# EAGLE design LED Daughterboard (EAGLE 8.4.1)
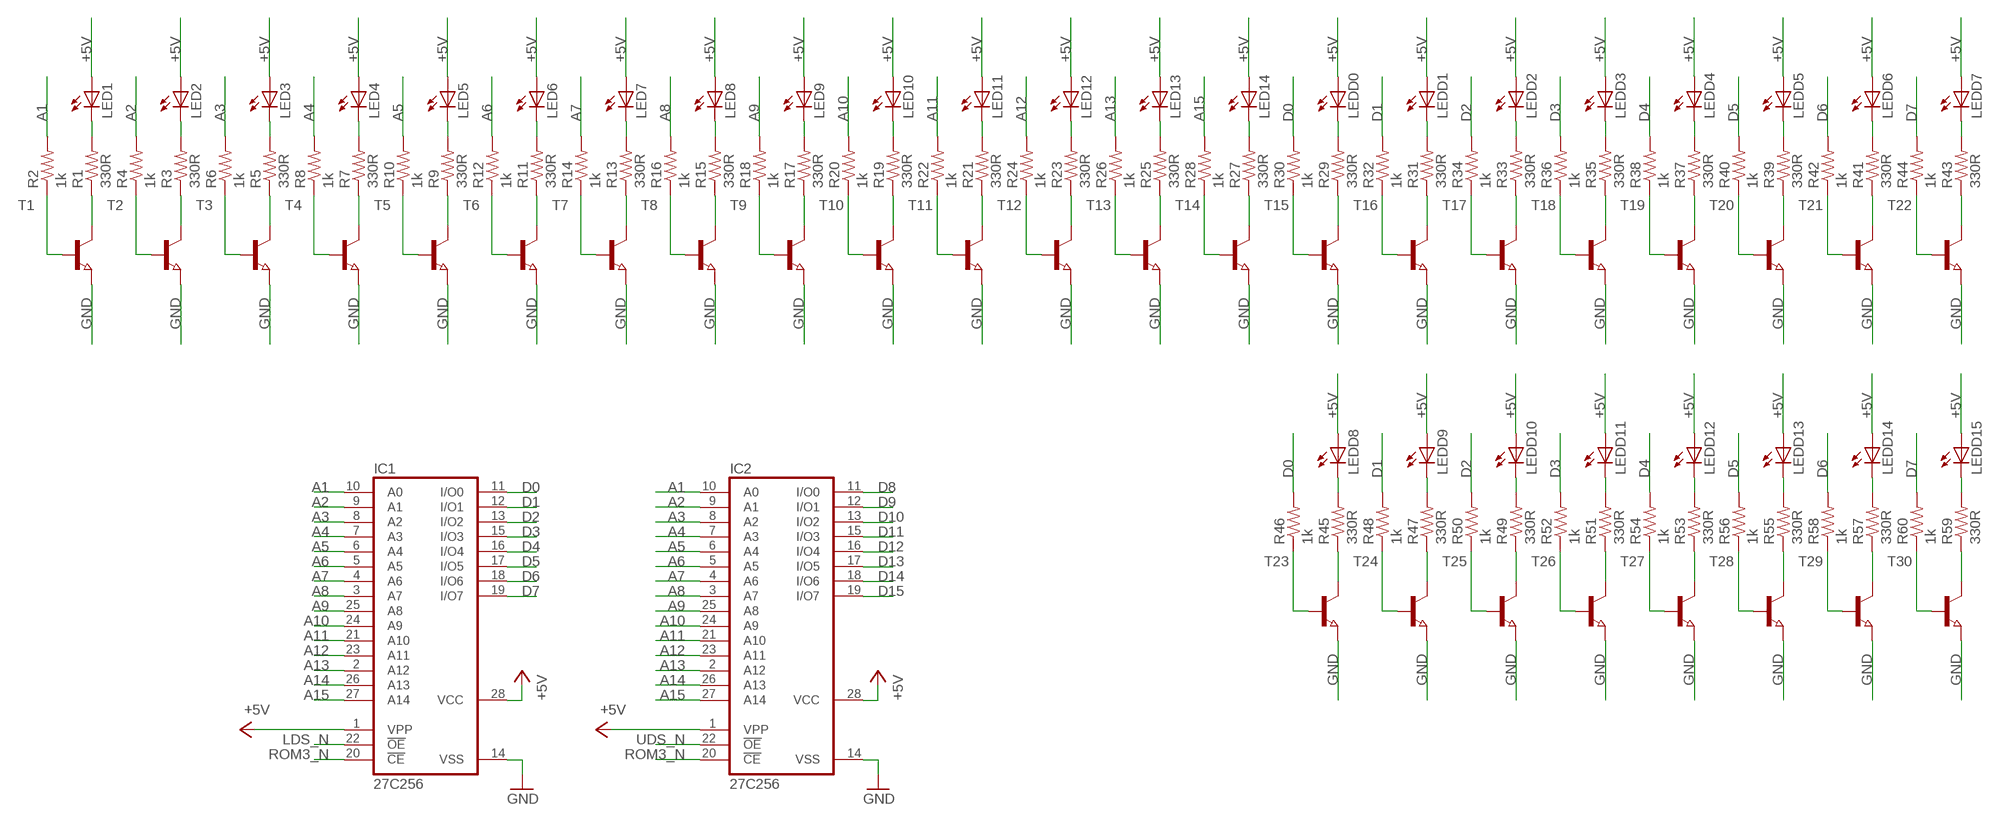
[diagram p0: schematic, sheet 1]

## Parts
IC1  27C256  27C256AG  [DIL28-6]
IC2  27C256  27C256AG  [DIL28-6]
LED1  LEDCHIP-LED0805  [CHIP-LED0805]
LED2  LEDCHIP-LED0805  [CHIP-LED0805]
LED3  LEDCHIP-LED0805  [CHIP-LED0805]
LED4  LEDCHIP-LED0805  [CHIP-LED0805]
LED5  LEDCHIP-LED0805  [CHIP-LED0805]
LED6  LEDCHIP-LED0805  [CHIP-LED0805]
LED7  LEDCHIP-LED0805  [CHIP-LED0805]
LED8  LEDCHIP-LED0805  [CHIP-LED0805]
LED9  LEDCHIP-LED0805  [CHIP-LED0805]
LED10  LEDCHIP-LED0805  [CHIP-LED0805]
LED11  LEDCHIP-LED0805  [CHIP-LED0805]
LED12  LEDCHIP-LED0805  [CHIP-LED0805]
LED13  LEDCHIP-LED0805  [CHIP-LED0805]
LED14  LEDCHIP-LED0805  [CHIP-LED0805]
LEDD0  LEDCHIP-LED0805  [CHIP-LED0805]
LEDD1  LEDCHIP-LED0805  [CHIP-LED0805]
LEDD2  LEDCHIP-LED0805  [CHIP-LED0805]
LEDD3  LEDCHIP-LED0805  [CHIP-LED0805]
LEDD4  LEDCHIP-LED0805  [CHIP-LED0805]
LEDD5  LEDCHIP-LED0805  [CHIP-LED0805]
LEDD6  LEDCHIP-LED0805  [CHIP-LED0805]
LEDD7  LEDCHIP-LED0805  [CHIP-LED0805]
LEDD8  LEDCHIP-LED0805  [CHIP-LED0805]
LEDD9  LEDCHIP-LED0805  [CHIP-LED0805]
LEDD10  LEDCHIP-LED0805  [CHIP-LED0805]
LEDD11  LEDCHIP-LED0805  [CHIP-LED0805]
LEDD12  LEDCHIP-LED0805  [CHIP-LED0805]
LEDD13  LEDCHIP-LED0805  [CHIP-LED0805]
LEDD14  LEDCHIP-LED0805  [CHIP-LED0805]
LEDD15  LEDCHIP-LED0805  [CHIP-LED0805]
R1  330R  R-US_M0805  [M0805]
R2  1k  R-US_M0805  [M0805]
R3  330R  R-US_M0805  [M0805]
R4  1k  R-US_M0805  [M0805]
R5  330R  R-US_M0805  [M0805]
R6  1k  R-US_M0805  [M0805]
R7  330R  R-US_M0805  [M0805]
R8  1k  R-US_M0805  [M0805]
R9  330R  R-US_M0805  [M0805]
R10  1k  R-US_M0805  [M0805]
R11  330R  R-US_M0805  [M0805]
R12  1k  R-US_M0805  [M0805]
R13  330R  R-US_M0805  [M0805]
R14  1k  R-US_M0805  [M0805]
R15  330R  R-US_M0805  [M0805]
R16  1k  R-US_M0805  [M0805]
R17  330R  R-US_M0805  [M0805]
R18  1k  R-US_M0805  [M0805]
R19  330R  R-US_M0805  [M0805]
R20  1k  R-US_M0805  [M0805]
R21  330R  R-US_M0805  [M0805]
R22  1k  R-US_M0805  [M0805]
R23  330R  R-US_M0805  [M0805]
R24  1k  R-US_M0805  [M0805]
R25  330R  R-US_M0805  [M0805]
R26  1k  R-US_M0805  [M0805]
R27  330R  R-US_M0805  [M0805]
R28  1k  R-US_M0805  [M0805]
R29  330R  R-US_M0805  [M0805]
R30  1k  R-US_M0805  [M0805]
R31  330R  R-US_M0805  [M0805]
R32  1k  R-US_M0805  [M0805]
R33  330R  R-US_M0805  [M0805]
R34  1k  R-US_M0805  [M0805]
R35  330R  R-US_M0805  [M0805]
R36  1k  R-US_M0805  [M0805]
R37  330R  R-US_M0805  [M0805]
R38  1k  R-US_M0805  [M0805]
R39  330R  R-US_M0805  [M0805]
R40  1k  R-US_M0805  [M0805]
R41  330R  R-US_M0805  [M0805]
R42  1k  R-US_M0805  [M0805]
R43  330R  R-US_M0805  [M0805]
R44  1k  R-US_M0805  [M0805]
R45  330R  R-US_M0805  [M0805]
R46  1k  R-US_M0805  [M0805]
R47  330R  R-US_M0805  [M0805]
R48  1k  R-US_M0805  [M0805]
R49  330R  R-US_M0805  [M0805]
R50  1k  R-US_M0805  [M0805]
R51  330R  R-US_M0805  [M0805]
R52  1k  R-US_M0805  [M0805]
R53  330R  R-US_M0805  [M0805]
R54  1k  R-US_M0805  [M0805]
R55  330R  R-US_M0805  [M0805]
R56  1k  R-US_M0805  [M0805]
R57  330R  R-US_M0805  [M0805]
R58  1k  R-US_M0805  [M0805]
R59  330R  R-US_M0805  [M0805]
R60  1k  R-US_M0805  [M0805]
T1  NPN-TRANSISTOR_SOT23  [SOT23]
T2  NPN-TRANSISTOR_SOT23  [SOT23]
T3  NPN-TRANSISTOR_SOT23  [SOT23]
T4  NPN-TRANSISTOR_SOT23  [SOT23]
T5  NPN-TRANSISTOR_SOT23  [SOT23]
T6  NPN-TRANSISTOR_SOT23  [SOT23]
T7  NPN-TRANSISTOR_SOT23  [SOT23]
T8  NPN-TRANSISTOR_SOT23  [SOT23]
T9  NPN-TRANSISTOR_SOT23  [SOT23]
T10  NPN-TRANSISTOR_SOT23  [SOT23]
T11  NPN-TRANSISTOR_SOT23  [SOT23]
T12  NPN-TRANSISTOR_SOT23  [SOT23]
T13  NPN-TRANSISTOR_SOT23  [SOT23]
T14  NPN-TRANSISTOR_SOT23  [SOT23]
T15  NPN-TRANSISTOR_SOT23  [SOT23]
T16  NPN-TRANSISTOR_SOT23  [SOT23]
T17  NPN-TRANSISTOR_SOT23  [SOT23]
T18  NPN-TRANSISTOR_SOT23  [SOT23]
T19  NPN-TRANSISTOR_SOT23  [SOT23]
T20  NPN-TRANSISTOR_SOT23  [SOT23]
T21  NPN-TRANSISTOR_SOT23  [SOT23]
T22  NPN-TRANSISTOR_SOT23  [SOT23]
T23  NPN-TRANSISTOR_SOT23  [SOT23]
T24  NPN-TRANSISTOR_SOT23  [SOT23]
T25  NPN-TRANSISTOR_SOT23  [SOT23]
T26  NPN-TRANSISTOR_SOT23  [SOT23]
T27  NPN-TRANSISTOR_SOT23  [SOT23]
T28  NPN-TRANSISTOR_SOT23  [SOT23]
T29  NPN-TRANSISTOR_SOT23  [SOT23]
T30  NPN-TRANSISTOR_SOT23  [SOT23]

## Nets
+5V: IC1.1(VPP) IC1.28(VCC) IC2.1(VPP) IC2.28(VCC) LED1.A LED2.A LED3.A LED4.A LED5.A LED6.A LED7.A LED8.A LED9.A LED10.A LED11.A LED12.A LED13.A LED14.A LEDD0.A LEDD1.A LEDD2.A LEDD3.A LEDD4.A LEDD5.A LEDD6.A LEDD7.A LEDD8.A LEDD9.A LEDD10.A LEDD11.A LEDD12.A LEDD13.A LEDD14.A LEDD15.A
A1: IC1.10(A0) IC2.10(A0) R2.2
A2: IC1.9(A1) IC2.9(A1) R4.2
A3: IC1.8(A2) IC2.8(A2) R6.2
A4: IC1.7(A3) IC2.7(A3) R8.2
A5: IC1.6(A4) IC2.6(A4) R10.2
A6: IC1.5(A5) IC2.5(A5) R12.2
A7: IC1.4(A6) IC2.4(A6) R14.2
A8: IC1.3(A7) IC2.3(A7) R16.2
A9: IC1.25(A8) IC2.25(A8) R18.2
A10: IC1.24(A9) IC2.24(A9) R20.2
A11: IC1.21(A10) IC2.21(A10) R22.2
A12: IC1.23(A11) IC2.23(A11) R24.2
A13: IC1.2(A12) IC2.2(A12) R26.2
A14: IC1.26(A13) IC2.26(A13)
A15: IC1.27(A14) IC2.27(A14) R28.2
D0: IC1.11(I/O0) R30.2 R46.2
D1: IC1.12(I/O1) R32.2 R48.2
D2: IC1.13(I/O2) R34.2 R50.2
D3: IC1.15(I/O3) R36.2 R52.2
D4: IC1.16(I/O4) R38.2 R54.2
D5: IC1.17(I/O5) R40.2 R56.2
D6: IC1.18(I/O6) R42.2 R58.2
D7: IC1.19(I/O7) R44.2 R60.2
D8: IC2.11(I/O0)
D9: IC2.12(I/O1)
D10: IC2.13(I/O2)
D11: IC2.15(I/O3)
D12: IC2.16(I/O4)
D13: IC2.17(I/O5)
D14: IC2.18(I/O6)
D15: IC2.19(I/O7)
GND: IC1.14(VSS) IC2.14(VSS) T1.2(E) T2.2(E) T3.2(E) T4.2(E) T5.2(E) T6.2(E) T7.2(E) T8.2(E) T9.2(E) T10.2(E) T11.2(E) T12.2(E) T13.2(E) T14.2(E) T15.2(E) T16.2(E) T17.2(E) T18.2(E) T19.2(E) T20.2(E) T21.2(E) T22.2(E) T23.2(E) T24.2(E) T25.2(E) T26.2(E) T27.2(E) T28.2(E) T29.2(E) T30.2(E)
LDS_N: IC1.22(!OE)
N$1: R2.1 T1.1(B)
N$2: LED1.C R1.2
N$3: R1.1 T1.3(C)
N$4: LEDD4.C R37.2
N$5: LED2.C R3.2
N$6: R3.1 T2.3(C)
N$7: R4.1 T2.1(B)
N$8: LED3.C R5.2
N$9: R5.1 T3.3(C)
N$10: R6.1 T3.1(B)
N$11: LED4.C R7.2
N$12: R7.1 T4.3(C)
N$13: R8.1 T4.1(B)
N$14: LED5.C R9.2
N$15: R9.1 T5.3(C)
N$16: R10.1 T5.1(B)
N$17: LED6.C R11.2
N$18: R11.1 T6.3(C)
N$19: R12.1 T6.1(B)
N$20: LED7.C R13.2
N$21: R13.1 T7.3(C)
N$22: R14.1 T7.1(B)
N$23: LED8.C R15.2
N$24: R15.1 T8.3(C)
N$25: R16.1 T8.1(B)
N$26: LED9.C R17.2
N$27: R17.1 T9.3(C)
N$28: R18.1 T9.1(B)
N$29: LED10.C R19.2
N$30: R19.1 T10.3(C)
N$31: R20.1 T10.1(B)
N$32: LED11.C R21.2
N$33: R21.1 T11.3(C)
N$34: R22.1 T11.1(B)
N$35: LED12.C R23.2
N$36: R23.1 T12.3(C)
N$37: R24.1 T12.1(B)
N$38: LED13.C R25.2
N$39: R25.1 T13.3(C)
N$40: R26.1 T13.1(B)
N$41: LED14.C R27.2
N$42: R27.1 T14.3(C)
N$43: R28.1 T14.1(B)
N$44: LEDD0.C R29.2
N$45: R29.1 T15.3(C)
N$46: R30.1 T15.1(B)
N$47: LEDD1.C R31.2
N$48: R31.1 T16.3(C)
N$49: R32.1 T16.1(B)
N$50: LEDD2.C R33.2
N$51: R33.1 T17.3(C)
N$52: R34.1 T17.1(B)
N$53: LEDD3.C R35.2
N$54: R35.1 T18.3(C)
N$55: R36.1 T18.1(B)
N$56: R37.1 T19.3(C)
N$57: R38.1 T19.1(B)
N$58: LEDD5.C R39.2
N$59: R39.1 T20.3(C)
N$60: R40.1 T20.1(B)
N$61: LEDD6.C R41.2
N$62: R41.1 T21.3(C)
N$63: R42.1 T21.1(B)
N$64: LEDD7.C R43.2
N$65: R43.1 T22.3(C)
N$66: R44.1 T22.1(B)
N$67: LEDD8.C R45.2
N$68: R45.1 T23.3(C)
N$69: R46.1 T23.1(B)
N$70: LEDD9.C R47.2
N$71: R47.1 T24.3(C)
N$72: R48.1 T24.1(B)
N$73: LEDD10.C R49.2
N$74: R49.1 T25.3(C)
N$75: R50.1 T25.1(B)
N$76: LEDD11.C R51.2
N$77: R51.1 T26.3(C)
N$78: R52.1 T26.1(B)
N$79: LEDD12.C R53.2
N$80: R53.1 T27.3(C)
N$81: R54.1 T27.1(B)
N$82: LEDD13.C R55.2
N$83: R55.1 T28.3(C)
N$84: R56.1 T28.1(B)
N$85: LEDD14.C R57.2
N$86: R57.1 T29.3(C)
N$87: R58.1 T29.1(B)
N$88: LEDD15.C R59.2
N$89: R59.1 T30.3(C)
N$90: R60.1 T30.1(B)
ROM3_N: IC1.20(!CE) IC2.20(!CE)
UDS_N: IC2.22(!OE)

## Library data of the parts
IC1 IC2 = memory-hitachi:27C256AG: MEMORY; OC_FARNELL: unknown; OC_NEWARK: unknown
LED1-LED14 LEDD0 LEDD1-LEDD15 = led:LED: LED OSRAM: - CHIPLED LG R971, LG N971, LY N971, LG Q971, LY Q971, LO R971, LY R971 LH N974, LH R974 LS Q976, LO Q976, LY Q976 LO Q996 - Hyper CHIPLED LW Q18S LB Q993, LB Q99A, LB R99A - SideLED LS A670, LO A670, LY A670, LG A670, LP A670 LB A673, LV A673, LT A673, LW A673 LH A674 LY A675 LS A676, LA A676, LO A676, LY A676, LW A676 LS A679, LY A679, LG A679 - Hyper Micro SIDELED® LS Y876, LA Y876, LO Y876, LY Y876 LT Y87S - SmartLED LW L88C, LW L88S LB L89C, LB L89S, LG L890 LS L89K, LO L89K, LY L89K LS L896, LA L896, LO L896, LY L896 - TOPLED LS T670, LO T670, LY T670, LG T670, LP T670 LSG T670, LSP T670, LSY T670, LOP T670, LYG T670 LG T671, LOG T671, LSG T671 LB T673, LV T673, LT T673, LW T673 LH T674 LS T676, LA T676, LO T676, LY T676, LB T676, LH T676, LSB T676, LW T676 LB T67C, LV T67C, LT T67C, LS T67K, LO T67K, LY T67K, LW E67C LS E67B, LA E67B, LO E67B, LY E67B, LB E67C, LV E67C, LT E67C LW T67C LS T679, LY T679, LG T679 LS T770, LO T770, LY T770, LG T770, LP T770 LB T773, LV T773, LT T773, LW T773 LH T774 LS E675, LA E675, LY E675, LS T675 LS T776, LA T776, LO T776, LY T776, LB T776 LHGB T686 LT T68C, LB T68C - Hyper Mini TOPLED® LB M676 - Mini TOPLED Santana® LG M470 LS M47K, LO M47K, LY M47K Source: http://www.osram.convergy.de LUXEON: - LUMILED® LXK2-PW12-R00, LXK2-PW12-S00, LXK2-PW14-U00, LXK2-PW14-V00 LXK2-PM12-R00, LXK2-PM12-S00, LXK2-PM14-U00 LXK2-PE12-Q00, LXK2-PE12-R00, LXK2-PE12-S00, LXK2-PE14-T00, LXK2-PE14-U00 LXK2-PB12-K00, LXK2-PB12-L00, LXK2-PB12-M00, LXK2-PB14-N00, LXK2-PB14-P00, LXK2-PB14-Q00 LXK2-PR12-L00, LXK2-PR12-M00, LXK2-PR14-Q00, LXK2-PR14-R00 LXK2-PD12-Q00, LXK2-PD12-R00, LXK2-PD12-S00 LXK2-PH12-R00, LXK2-PH12-S00 LXK2-PL12-P00, LXK2-PL12-Q00, LXK2-PL12-R00 Source: www.luxeon.com KINGBRIGHT: KA-3528ASYC Source: www.kingbright.com
R1-R60 = resistor:R-US_: RESISTOR, American symbol
T1-T30 = semicon-smd-ipc:NPN-TRANSISTOR_: NPN TRANSISTOR

## Net classes
0 default: width 0.4 mm

## Board
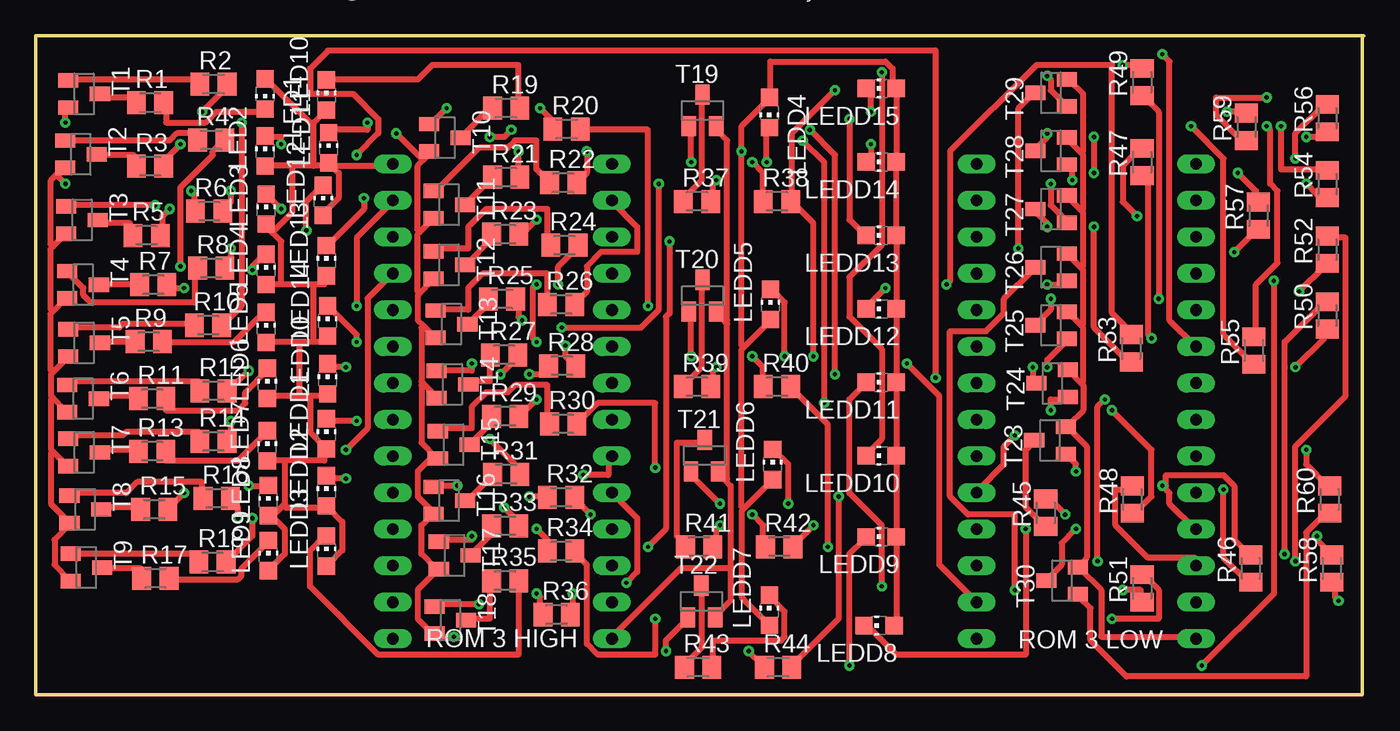
[diagram p1: board, top side]
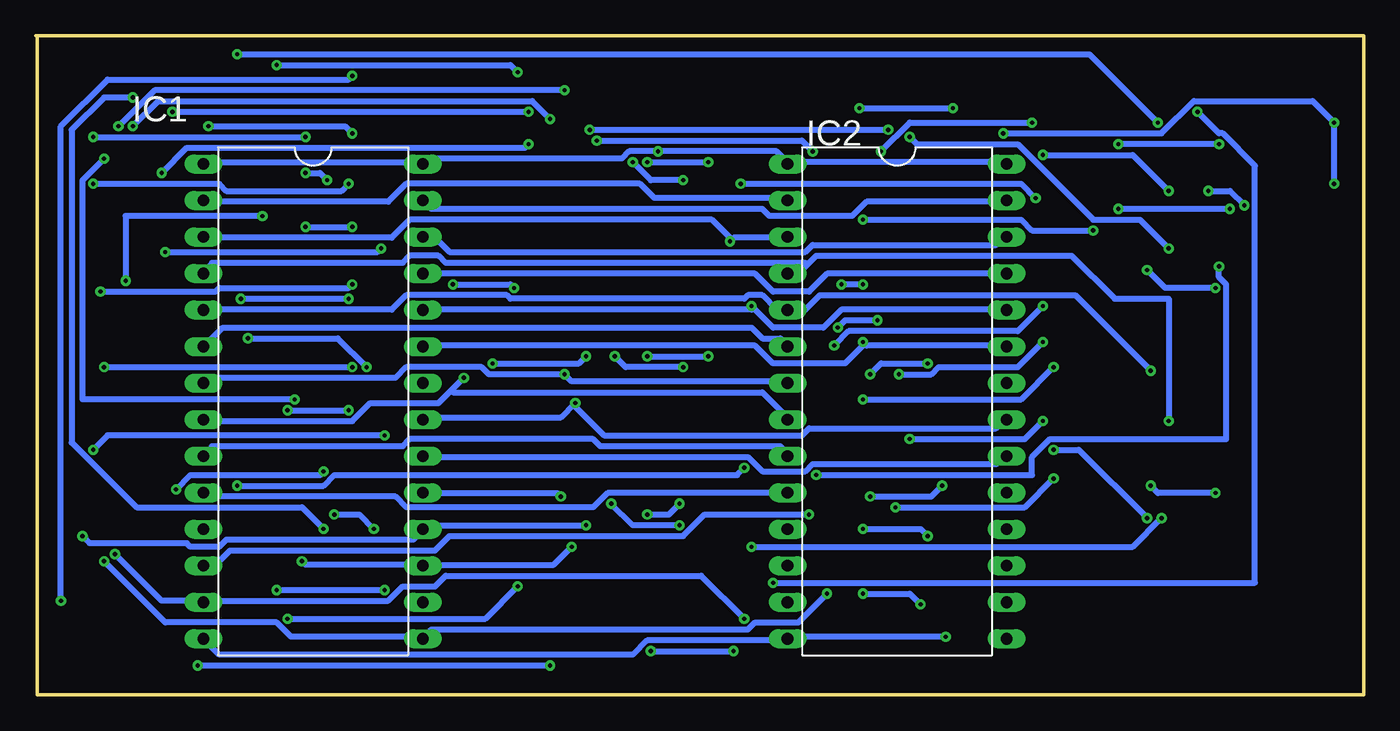
[diagram p2: board, bottom side, seen from below]

Size 92.28 x 45.8 mm. Coordinates in mm from the lower left corner, seen from the top.
Outline: 0,45.8 92.28,45.8 92.2,45.72 92.2,0 0,0 0,45.8
Copper layers (1*16): Top 0.035mm / dielectric 1.5mm / Bottom 0.035mm
Design rules "default *": minimum track width 6mil, minimum drill 0.3mm, track to track 6mil, track to pad 6mil, pad to pad 6mil, via to via 6mil, smd to smd 6mil, copper to edge 20mil, drill to drill 6mil, minimum pad ring 10mil, minimum via ring 8mil, stop-mask expansion 1mil, vias tented up to drill 0mil, thermal gap 10mil

### Footprints (pad centres in the part's own frame; a part is rotated, then mirrored left to right if it is on the bottom)
DIL28-6 = drill 0.813 long: 1 -16.51,-7.62; 2 -13.97,-7.62; 3 -11.43,-7.62; 4 -8.89,-7.62; 5 -6.35,-7.62; 6 -3.81,-7.62; 7 -1.27,-7.62; 8 1.27,-7.62; 9 3.81,-7.62; 10 6.35,-7.62; 11 8.89,-7.62; 12 11.43,-7.62; 13 13.97,-7.62; 14 16.51,-7.62; 15 16.51,7.62; 16 13.97,7.62; 17 11.43,7.62; 18 8.89,7.62; 19 6.35,7.62; 20 3.81,7.62; 21 1.27,7.62; 22 -1.27,7.62; 23 -3.81,7.62; 24 -6.35,7.62; 25 -8.89,7.62; 26 -11.43,7.62; 27 -13.97,7.62; 28 -16.51,7.62
CHIP-LED0805 = smd 1.2 x 1.2: A 0,-1.05; C 0,1.05
M0805 = smd 1.3 x 1.6: 1 -0.95,0; 2 0.95,0
SOT23 = smd 1 x 1.4: 1 -0.95,-1.1; 2 0.95,-1.1; 3 0,1.1

### Placement (x,y rotation side)
IC1  73.01,20.39 270 bottom
IC2  32.42,20.39 270 bottom
LED1  15.93,41.76 180 top
LED2  15.93,37.8 0 top
LED3  16,33.76 0 top
LED4  16,29.57 0 top
LED5  16,25.53 0 top
LED6  16.08,21.64 0 top
LED7  16.08,17.3 0 top
LED8  16.15,13.49 0 top
LED9  16.15,9.68 0 top
LED10  20.19,41.68 0 top
LED11  20.35,38.02 0 top
LED12  19.96,34.37 0 top
LED13  20.19,30.18 0 top
LED14  20.27,25.98 0 top
LEDD0  20.27,21.95 0 top
LEDD1  20.19,18.14 0 top
LEDD2  20.19,14.17 0 top
LEDD3  20.19,9.98 0 top
LEDD4  50.98,40.46 180 top
LEDD5  51.05,27.13 0 top
LEDD6  51.21,16 0 top
LEDD7  50.98,5.87 0 top
LEDD8  58.6,4.8 90 top
LEDD9  58.75,10.97 90 top
LEDD10  58.75,16.61 90 top
LEDD11  58.75,21.72 90 top
LEDD12  58.75,26.82 90 top
LEDD13  58.75,31.93 90 top
LEDD14  58.75,37.03 90 top
LEDD15  58.75,42.14 90 top
R1  7.92,41.15 0 top
R2  12.34,42.44 0 top
R3  7.92,36.73 0 top
R4  12.19,38.56 0 top
R5  7.7,31.93 0 top
R6  12.04,33.6 0 top
R7  8.15,28.5 0 top
R8  12.19,29.64 0 top
R9  7.85,24.54 0 top
R10  11.96,25.68 0 top
R11  8.08,20.57 0 top
R12  12.34,21.11 0 top
R13  8.08,16.92 0 top
R14  12.34,17.6 0 top
R15  8.23,12.88 0 top
R16  12.57,13.64 0 top
R17  8.31,8.08 0 top
R18  12.27,9.22 0 top
R19  32.69,40.77 0 top
R20  36.88,39.32 0 top
R21  32.69,35.97 0 top
R22  36.65,35.59 0 top
R23  32.61,32 0 top
R24  36.73,31.24 0 top
R25  32.38,27.51 0 top
R26  36.5,27.13 0 top
R27  32.54,23.62 0 top
R28  36.58,22.86 0 top
R29  32.61,19.35 0 top
R30  36.65,18.82 0 top
R31  32.69,15.32 0 top
R32  36.5,13.72 0 top
R33  32.61,11.73 0 top
R34  36.5,9.98 0 top
R35  32.61,7.92 0 top
R36  36.2,5.56 0 top
R37  45.95,34.29 0 top
R38  51.51,34.29 0 top
R39  45.95,21.41 0 top
R40  51.51,21.41 0 top
R41  46.1,10.29 0 top
R42  51.66,10.29 0 top
R43  46.02,1.91 0 top
R44  51.59,1.91 0 top
R45  70.18,12.65 90 top
R46  84.43,8.76 90 top
R47  76.89,37.03 90 top
R48  76.2,13.56 90 top
R49  76.89,42.6 90 top
R50  89.76,26.37 90 top
R51  76.89,7.39 90 top
R52  89.76,30.94 90 top
R53  76.12,24.08 90 top
R54  89.76,35.51 90 top
R55  84.66,23.93 90 top
R56  89.76,40.08 90 top
R57  84.96,33.3 90 top
R58  90.07,8.76 90 top
R59  84.12,39.47 90 top
R60  89.92,13.56 90 top
T1  3.35,41.76 270 top
T2  3.12,37.57 270 top
T3  3.2,32.99 270 top
T4  3.28,28.5 270 top
T5  3.35,24.46 270 top
T6  3.28,20.57 270 top
T7  3.35,16.84 270 top
T8  3.43,12.88 270 top
T9  3.51,8.84 270 top
T10  28.42,38.71 270 top
T11  28.73,34.06 270 top
T12  28.73,29.87 270 top
T13  28.88,25.76 270 top
T14  28.96,21.56 270 top
T15  29.03,17.37 270 top
T16  28.73,13.49 270 top
T17  29.11,9.68 270 top
T18  28.8,5.18 270 top
T19  46.33,40.61 0 top
T20  46.33,27.74 0 top
T21  46.48,16.61 0 top
T22  46.25,6.48 0 top
T23  70.48,17.68 90 top
T24  70.64,21.64 90 top
T25  70.56,25.68 90 top
T26  70.56,29.72 90 top
T27  70.56,33.76 90 top
T28  70.56,37.8 90 top
T29  70.56,41.83 90 top
T30  71.32,7.92 90 top

### Tracks (layer width: path | path; a pad name or v marks a point on that pad's centre or on a via)
+5V  (via drill 0.3)
  Top 0.4: LEDD8.A 59.79,5.02 59.79,10.77 LEDD9.A 59.79,11.02 59.79,16.52 LEDD10.A 59.79,16.77 59.79,21.52 LEDD11.A 59.79,21.77 59.79,26.77 LEDD12.A 59.79,27.02 59.79,31.77 LEDD13.A 59.79,32.02 LEDD14.A 59.79,37.27 59.79,42.02 LEDD15.A 59.79,42.27 59.54,42.52 59.54,43.52 59.04,44.02 51.04,44.02 51.04,41.52 LEDD4.A 50.79,41.27 49.04,39.52 v49.04,37.77 49.04,24.27 49.17,24.15 | 49.17,12.9 51.04,14.77 LEDD6.A | 49.17,12.9 49.04,12.77 49.04,6.77 50.79,5.02 LEDD7.A | 49.17,24.15 49.04,24.02 49.04,13.02 49.17,12.9 | 49.17,24.15 51.04,26.02 LEDD5.A | LEDD3.A 20.29,9.02 21.29,10.02 21.29,12.02 20.29,13.02 LEDD2.A 20.04,13.02 17.29,13.02 17.17,13.15 | LED9.A 16.29,8.77 17.29,9.77 17.29,11.52 16.29,12.52 LED8.A 16.54,12.52 17.17,13.15 | 17.29,16.27 20.04,16.27 20.04,17.02 LEDD1.A 20.04,17.27 19.04,18.27 19.04,20.77 | 17.29,16.27 16.29,16.27 LED7.A | 17.17,13.15 17.29,13.27 17.29,16.27 | 19.29,28.52 20.04,28.52 20.04,29.02 LED13.A | 19.29,28.52 17.04,28.52 | 17.04,28.52 16.04,28.52 LED4.A | 17.04,28.52 17.04,31.52 16.04,32.52 LED3.A 16.54,32.27 17.79,33.52 17.79,36.77 | 19.04,20.77 20.04,20.77 LEDD0.A | 19.04,20.77 18.29,20.77 | 18.29,20.77 16.29,20.77 LED6.A | 19.29,24.52 20.04,24.52 20.04,24.77 LED14.A | 19.29,24.52 18.29,24.52 | 18.29,24.52 16.04,24.52 LED5.A | 18.29,24.52 18.29,20.77 | 19.29,24.52 19.29,28.52 | LED12.A 20.04,33.52 21.04,34.52 21.04,36.27 20.54,36.77 LED11.A | 19.29,36.77 20.29,36.77 LED11.A | 19.29,36.77 17.79,36.77 | 17.79,36.77 16.04,36.77 LED2.A | 19.29,36.77 19.29,39.52 | 19.29,39.52 19.29,39.77 20.04,40.52 LED10.A | 19.29,39.52 16.04,42.77 LED1.A | IC2.28 24.79,36.77 20.79,36.77 LED11.A
  Bottom 0.4: IC1.1 80.54,37.02 65.54,37.02 IC1.28 65.29,37.02 65.04,37.27 51.54,37.27 51.04,37.77 v49.04,37.77 40.79,37.77 40.04,37.02 IC2.1 39.79,37.02 25.04,37.02 IC2.28
A1  (via drill 0.3)
  Top 0.4: v11.54,40.52 13.29,42.27 R2.2 | v41.04,7.77 41.79,8.52 41.79,12.27 40.04,14.02 IC2.10
  Bottom 0.4: v11.54,40.52 10.04,39.02 9.79,39.02 7.54,36.77 7.54,7.77 v41.04,7.77 | IC1.10 80.54,14.02 80.29,13.77 67.29,13.77 66.54,13.02 53.54,13.02 52.54,14.02 40.04,14.02 IC2.10
A2  (via drill 0.3)
  Top 0.4: v10.04,29.77 10.04,35.27 12.29,37.52 12.29,37.77 13.04,38.52 R4.2 | v38.04,15.27 39.79,15.27 39.79,16.52 IC2.9
  Bottom 0.4: v10.04,29.77 10.04,29.02 9.54,28.52 9.54,17.77 21.79,17.77 23.04,16.52 23.04,15.27 v38.04,15.27 | IC1.9 80.54,16.77 80.04,17.27 66.79,17.27 66.29,17.77 53.54,17.77 53.04,17.27 40.54,17.27 40.04,16.77 IC2.9
A3  (via drill 0.3)
  Top 0.4: v13.54,35.02 13.54,34.27 13.04,33.77 R6.2 | v22.29,37.52 23.79,39.02 23.79,40.02 22.04,41.77 19.04,41.77 19.04,43.52 20.29,44.77 62.54,44.77 v62.54,22.02
  Bottom 0.4: v13.54,35.02 16.04,37.52 v22.29,37.52 | 63.42,21.15 64.29,20.27 69.04,20.27 70.29,19.02 80.54,19.02 IC1.8 | 63.42,21.15 v62.54,22.02 | IC2.8 40.04,19.27 41.79,21.02 63.29,21.02 63.42,21.15
A4  (via drill 0.3)
  Top 0.4: v13.54,31.02 13.54,30.02 13.29,29.77 R8.2 | v31.54,38.77 32.54,38.77 v33.04,39.27 | v53.79,39.27 55.54,37.52 v55.54,22.27
  Bottom 0.4: v13.54,31.02 15.54,33.02 18.79,33.02 24.04,38.27 31.04,38.27 v31.54,38.77 | v53.79,39.27 v33.04,39.27 | IC2.7 40.04,21.77 55.04,21.77 v55.54,22.27 60.79,22.27 61.29,22.77 66.54,22.77 67.29,22.02 80.29,22.02 80.54,21.77 IC1.7
A5  (via drill 0.3)
  Top 0.4: v14.29,39.77 14.29,27.02 13.04,25.77 R10.2 | v78.29,44.52 78.79,44.02 78.79,26.02 80.54,24.27 IC1.6
  Bottom 0.4: v14.29,39.77 19.04,44.52 v78.29,44.52 | IC2.6 40.04,24.27 40.54,24.77 41.79,24.77 42.54,25.52 79.29,25.52 80.54,24.27 IC1.6
A6  (via drill 0.3)
  Top 0.4: v14.79,22.52 13.54,21.27 R12.2
  Bottom 0.4: v14.79,22.52 20.04,27.77 37.79,27.77 38.79,26.77 39.79,26.77 IC2.5 40.04,26.77 40.79,26.77 41.79,27.77 42.79,27.77 43.04,27.52 59.29,27.52 59.54,27.77 66.54,27.77 67.54,26.77 80.54,26.77 IC1.5
A7  (via drill 0.3)
  Top 0.4: v13.54,19.02 13.54,17.77 R14.2
  Bottom 0.4: v13.54,19.02 13.54,27.52 17.29,27.52 20.29,30.52 38.04,30.52 38.67,29.9 | 38.67,29.9 39.04,29.52 39.79,29.52 IC2.4 | IC1.4 80.54,29.52 80.04,30.02 66.79,30.02 66.29,30.52 64.29,30.52 63.79,30.02 38.79,30.02 38.67,29.9
A8  (via drill 0.3)
  Top 0.4: v14.04,12.27 14.04,13.02 13.54,13.52 R16.2 | v42.54,10.27 43.79,11.52 43.79,26.27 44.04,26.52 v44.04,31.52
  Bottom 0.4: v14.04,12.27 16.04,10.27 v42.54,10.27 | IC2.3 40.04,31.77 43.79,31.77 v44.04,31.52 44.04,31.77 45.29,33.02 66.29,33.02 67.54,31.77 80.54,31.77 IC1.3
A9  (via drill 0.3)
  Top 0.4: v15.04,12.27 15.04,11.02 13.29,9.27 R18.2 | v21.54,17.02 23.04,18.52 23.04,27.52 IC2.25
  Bottom 0.4: v15.04,12.27 19.79,17.02 v21.54,17.02 | IC1.25 65.29,29.27 42.29,29.27 41.04,28.02 38.54,28.02 37.29,29.27 25.04,29.27 IC2.25
A10  (via drill 0.3)
  Top 0.4: v42.54,27.02 42.54,39.27 38.04,39.27 R20.2
  Bottom 0.4: IC2.24 25.04,26.77 36.29,26.77 37.54,25.52 41.04,25.52 v42.54,27.02 42.54,26.77 65.29,26.77 IC1.24
A11  (via drill 0.3)
  Top 0.4: v38.29,37.77 38.29,36.27 37.79,35.77 R22.2 | v53.29,38.52 54.79,37.02 v54.79,20.27
  Bottom 0.4: v38.29,37.77 39.04,38.52 v53.29,38.52 | IC1.21 65.29,19.27 55.79,19.27 v54.79,20.27 54.79,20.02 52.79,18.02 39.04,18.02 38.54,18.52 25.54,18.52 25.04,19.02 IC2.21
A12  (via drill 0.3)
  Top 0.4: v36.29,28.52 36.29,29.77 37.54,31.02 R24.2 | v34.79,28.52 34.54,28.27 34.54,24.77 v34.79,24.52
  Bottom 0.4: v34.79,28.52 v36.29,28.52 | IC2.23 25.04,24.27 34.54,24.27 v34.79,24.52 34.79,24.27 36.04,23.02 41.04,23.02 42.29,24.27 65.29,24.27 IC1.23
A13
  Top 0.4: R26.2 37.54,27.27 38.29,28.02 38.29,29.77 39.29,30.77 41.79,30.77 41.79,32.52 40.04,34.27 IC2.2
  Bottom 0.4: IC1.2 80.54,34.27 67.79,34.27 66.54,35.52 50.29,35.52 49.29,34.52 40.04,34.52 IC2.2
A14
  Bottom 0.4: IC2.26 25.04,31.77 25.54,31.27 38.29,31.27 38.79,30.77 63.54,30.77 64.54,31.77 65.29,31.77 IC1.26
A15  (via drill 0.3)
  Top 0.4: v36.79,24.27 36.79,23.52 37.29,23.02 R28.2 | v22.29,27.02 22.29,31.77 24.79,34.27 IC2.27
  Bottom 0.4: v36.79,24.27 35.79,25.27 24.04,25.27 v22.29,27.02 | IC1.27 65.29,34.27 64.79,33.77 41.79,33.77 41.29,33.27 35.54,33.27 34.54,34.27 25.04,34.27 IC2.27
D0  (via drill 0.3)
  Top 0.4: v43.04,15.77 43.04,20.27 39.04,20.27 37.79,19.02 R30.2 | IC1.11 80.54,11.52 78.79,13.27 78.79,14.02 v78.29,14.52 78.54,14.52 78.54,15.27 82.54,15.27 83.29,14.52 83.29,10.77 84.29,9.77 R46.2
  Bottom 0.4: v43.04,15.77 43.54,15.27 71.54,15.27 72.29,14.52 v78.29,14.52
D1  (via drill 0.3)
  Top 0.4: v38.54,12.52 37.54,13.52 R32.2 | R48.2 76.04,14.27 75.04,14.27 75.04,11.77 77.29,9.52 80.54,9.52 80.54,9.02 IC1.12
  Bottom 0.4: v38.54,12.52 45.79,12.52 47.29,11.02 63.54,11.02 64.54,10.02 78.79,10.02 79.79,9.02 80.54,9.02 IC1.12
D2  (via drill 0.3)
  Top 0.4: v43.04,5.27 43.04,2.77 39.04,2.77 38.29,3.52 38.29,9.02 37.54,9.77 R34.2 | v86.79,9.77 86.79,24.52 89.54,27.27 R50.2
  Bottom 0.4: v43.04,5.27 46.04,8.27 63.79,8.27 64.54,7.52 66.79,7.52 67.79,6.52 80.54,6.52 IC1.13 80.79,6.52 83.54,6.52 v86.79,9.77
D3  (via drill 0.3)
  Top 0.4: v37.29,7.02 37.29,5.77 R36.2 | v87.54,9.27 87.54,17.27 91.04,20.77 91.04,31.77 89.79,31.77 R52.2
  Bottom 0.4: v37.29,7.02 39.29,5.02 42.29,5.02 42.79,4.52 64.79,4.52 65.29,4.02 IC1.15 65.54,4.02 74.54,4.02 75.54,5.02 83.29,5.02 v87.54,9.27
D4  (via drill 0.3)
  Top 0.4: v54.04,23.52 54.04,32.77 52.54,34.27 R38.2 52.54,34.52 52.54,39.02 v55.54,42.02 | v60.54,23.02 62.79,20.77 62.79,9.02 65.29,6.52 IC1.16 | v86.54,39.52 86.54,36.52 89.54,36.52 R54.2
  Bottom 0.4: v54.04,23.52 54.54,23.02 v60.54,23.02 | v86.54,39.52 84.04,42.02 v55.54,42.02
D5  (via drill 0.3)
  Top 0.4: v55.04,10.27 55.04,18.77 52.54,21.27 R40.2 | v87.54,37.27 87.54,39.02 89.54,41.02 R56.2 | v74.29,20.52 73.79,20.02 v73.79,9.27
  Bottom 0.4: v55.04,10.27 56.29,9.02 65.29,9.02 IC1.17 65.54,9.02 73.54,9.02 v73.79,9.27 | v87.54,37.27 89.04,35.77 89.04,20.52 v74.29,20.52
D6  (via drill 0.3)
  Top 0.4: v54.04,11.77 52.79,10.52 R42.2 | v89.04,11.02 89.04,10.77 90.04,9.77 R58.2
  Bottom 0.4: v54.04,11.77 65.04,11.77 65.29,11.52 IC1.18 65.54,11.27 66.04,10.77 79.04,10.77 79.54,10.27 81.54,10.27 81.79,10.52 88.54,10.52 v89.04,11.02
D7  (via drill 0.3)
  Top 0.4: v55.79,13.77 55.79,5.27 52.54,2.02 R44.2 | v88.29,17.02 88.29,16.02 89.79,14.52 R60.2 | v68.04,18.02 67.29,17.27 67.29,16.02 65.54,14.27 IC1.19
  Bottom 0.4: v55.79,13.77 56.04,14.02 65.29,14.02 IC1.19 | v88.29,17.02 87.29,18.02 v68.04,18.02
GND  (via drill 0.3)
  Top 0.4: 72.67,21.65 71.79,22.52 T24.2 | 72.67,21.65 72.79,21.52 72.79,19.77 71.79,18.77 T23.2 71.79,18.52 73.04,17.27 73.04,9.52 72.54,9.02 T30.2 72.54,8.77 74.04,7.27 74.04,4.02 80.54,4.02 IC1.14 | 72.67,25.65 72.79,25.52 72.79,21.77 72.67,21.65 | 72.67,25.65 71.79,26.52 T25.2 | 72.67,29.65 72.79,29.52 72.79,25.77 72.67,25.65 | 72.67,29.65 71.79,30.52 T26.2 | 72.67,33.65 72.79,33.52 72.79,29.77 72.67,29.65 | 72.67,33.65 71.79,34.52 T27.2 | 72.67,37.65 72.79,37.52 72.79,33.77 72.67,33.65 | 72.67,37.65 71.79,38.52 T28.2 | T29.2 71.79,42.77 72.79,41.77 72.79,37.77 72.67,37.65 | 48.29,8.77 48.29,14.52 47.92,14.9 | 48.29,8.77 48.29,6.52 47.29,5.52 T22.2 | 47.92,14.9 47.54,15.27 T21.2 | 47.92,25.9 48.04,25.77 48.04,15.02 47.92,14.9 | 47.92,25.9 47.29,26.52 T20.2 | T19.2 47.29,39.27 48.04,38.52 48.04,26.02 47.92,25.9 | 48.29,8.77 44.79,8.77 40.04,4.02 IC2.14 | T9.2 2.29,8.02 1.29,9.02 1.29,10.77 2.29,11.77 T8.2 2.29,12.02 1.04,13.27 1.04,16.77 1.17,16.9 | 1.17,20.65 1.04,20.77 1.04,22.27 1.17,22.4 | 1.17,20.65 2.04,19.77 T6.2 | 1.17,22.4 2.04,23.27 T5.2 | 1.17,16.9 1.04,17.02 1.04,20.52 1.17,20.65 | 1.17,16.9 2.04,16.02 T7.2 | 1.17,26.65 1.04,26.52 1.04,22.52 1.17,22.4 | 1.17,26.65 2.04,27.52 T4.2 | 1.17,31.15 1.04,31.02 1.04,26.77 1.17,26.65 | 1.17,31.15 2.04,32.02 T3.2 | 1.42,36.15 1.04,35.77 1.04,31.27 1.17,31.15 | 1.42,36.15 1.79,36.52 T2.2 | v2.04,39.77 2.04,40.77 T1.2 | 1.42,36.15 v2.04,35.52 | 26.92,25.65 26.54,26.02 26.54,27.77 26.67,27.9 | 26.92,25.65 27.54,25.02 T13.2 | 26.67,27.9 27.54,28.77 T12.2 | 26.67,32.15 26.54,32.02 26.54,28.02 26.67,27.9 | 26.67,32.15 27.54,33.02 T11.2 | 26.67,32.15 26.54,32.27 26.54,36.77 27.29,37.52 T10.2 26.79,37.27 v25.04,39.02
  Top 0.4: 26.92,21.65 26.79,21.77 26.79,25.52 26.92,25.65 | 26.92,21.65 27.79,20.77 T14.2 | 26.92,21.65 26.79,21.52 26.79,17.52 27.79,16.52 T15.2 27.54,16.52 26.54,15.52 26.54,13.77 27.54,12.77 T16.2 27.54,12.52 26.79,11.77 26.79,9.77 27.79,8.77 T17.2 27.79,8.52 26.54,7.27 26.54,5.27 27.54,4.27 T18.2 27.79,4.02 v29.04,4.02
  Bottom 0.4: v2.04,35.52 v2.04,39.77 3.54,41.27 11.79,41.27 14.04,39.02 v25.04,39.02 | v29.04,4.02 39.79,4.02 IC2.14 40.04,3.77 49.79,3.77 50.79,2.77 79.54,2.77 80.54,3.77 IC1.14
N$1
  Top 0.4: T1.1 2.29,42.77 11.29,42.77 11.29,42.52 R2.1
N$2
  Top 0.4: LED1.C 15.79,40.52 12.54,40.52 11.79,39.77 9.04,39.77 9.04,41.02 R1.2
N$3
  Top 0.4: T1.3 4.54,41.52 6.79,41.52 6.79,41.27 R1.1
N$4  (via drill 0.3)
  Top 0.4: v50.79,37.02 50.79,39.27 LEDD4.C | v47.29,35.77 47.04,35.52 47.04,34.52 R37.2
  Bottom 0.4: v50.79,37.02 49.54,35.77 v47.29,35.77
N$5  (via drill 0.3)
  Top 0.4: v17.04,38.27 17.04,38.77 16.04,38.77 LED2.C | v10.04,38.27 9.04,37.27 9.04,36.77 R3.2
  Bottom 0.4: v10.04,38.27 v17.04,38.27
N$6
  Top 0.4: T2.3 4.29,37.52 6.79,37.52 6.79,36.77 R3.1
N$7
  Top 0.4: T2.1 2.04,38.52 9.29,38.52 9.79,39.02 11.04,39.02 11.04,38.77 R4.1
N$8  (via drill 0.3)
  Top 0.4: v17.04,33.77 16.04,34.77 LED3.C | v9.29,33.77 8.79,33.27 8.79,32.02 R5.2
  Bottom 0.4: v9.29,33.77 v17.04,33.77
N$9
  Top 0.4: T3.3 4.54,32.77 6.54,32.77 6.54,32.02 R5.1
N$10  (via drill 0.3)
  Top 0.4: v8.29,34.02 2.29,34.02 T3.1 | v10.79,35.02 11.04,34.77 11.04,33.77 R6.1
  Bottom 0.4: v8.29,34.02 9.29,35.02 v10.79,35.02
N$11  (via drill 0.3)
  Top 0.4: v15.04,29.52 15.04,29.77 15.79,30.52 LED4.C | v10.29,28.27 9.29,28.27 R7.2
  Bottom 0.4: v15.04,29.52 13.79,28.27 v10.29,28.27
N$12
  Top 0.4: T4.3 4.54,28.52 7.04,28.52 R7.1
N$13
  Top 0.4: T4.1 2.29,29.27 3.29,28.27 3.29,27.77 3.79,27.27 11.04,27.27 11.04,29.52 R8.1
N$14
  Top 0.4: LED5.C 15.79,26.52 13.79,24.52 9.04,24.52 R9.2
N$15
  Top 0.4: T5.3 4.54,24.52 6.79,24.52 R9.1
N$16
  Top 0.4: T5.1 2.29,25.52 5.79,25.52 6.04,25.77 10.79,25.77 R10.1
N$17
  Top 0.4: LED6.C 16.04,22.52 14.54,21.02 14.54,20.27 14.04,19.77 9.04,19.77 9.04,20.52 R11.2
N$18
  Top 0.4: T6.3 4.54,20.77 7.04,20.77 R11.1
N$19
  Top 0.4: T6.1 2.29,21.77 11.29,21.77 11.29,21.27 R12.1
N$20
  Top 0.4: LED7.C 16.04,18.27 14.04,16.27 9.04,16.27 9.04,16.77 R13.2
N$21
  Top 0.4: T7.3 4.54,17.02 7.04,17.02 R13.1
N$22
  Top 0.4: T7.1 2.29,18.02 6.04,18.02 6.29,18.27 11.29,18.27 11.29,17.77 R14.1
N$23  (via drill 0.3)
  Top 0.4: v14.79,14.52 16.04,14.52 LED8.C | v10.29,14.02 9.29,13.02 R15.2
  Bottom 0.4: v14.79,14.52 14.29,14.02 v10.29,14.02
N$24
  Top 0.4: T8.3 4.54,13.02 7.04,13.02 R15.1
N$25
  Top 0.4: T8.1 2.54,14.02 6.29,14.02 7.04,14.77 11.54,14.77 11.54,13.77 R16.1
N$26
  Top 0.4: LED9.C 16.04,10.52 14.29,8.77 14.29,8.27 14.04,8.02 9.29,8.02 R17.2
N$27
  Top 0.4: T9.3 4.79,8.77 7.29,8.77 7.29,8.27 R17.1
N$28
  Top 0.4: T9.1 2.54,9.77 11.29,9.77 11.29,9.27 R18.1
N$29
  Top 0.4: LED10.C 20.29,42.77 26.54,42.77 27.54,43.77 33.54,43.77 33.54,40.77 R19.2
N$30
  Top 0.4: T10.3 29.54,38.77 31.54,40.77 R19.1
N$31  (via drill 0.3)
  Top 0.4: v28.54,40.77 27.54,39.77 T10.1 | v35.04,40.77 35.79,40.02 35.79,39.52 R20.1
  Bottom 0.4: v35.04,40.77 v28.54,40.77
N$32  (via drill 0.3)
  Top 0.4: v23.04,39.77 23.04,39.27 20.54,39.27 LED11.C | v33.54,37.77 33.54,36.02 R21.2
  Bottom 0.4: v23.04,39.77 31.54,39.77 v33.54,37.77
N$33
  Top 0.4: T11.3 30.04,34.27 31.54,35.77 R21.1
N$34
  Top 0.4: T11.1 27.79,35.02 30.79,38.02 32.79,38.02 33.29,38.52 34.79,38.52 34.79,36.52 35.54,35.77 R22.1
N$35  (via drill 0.3)
  Top 0.4: v18.79,32.27 18.79,34.27 19.79,35.27 LED12.C | v34.79,33.02 33.79,32.02 R23.2
  Bottom 0.4: v18.79,32.27 23.04,32.27 23.79,33.02 v34.79,33.02
N$36
  Top 0.4: T12.3 30.04,30.02 31.54,31.52 31.54,31.77 R23.1
N$37
  Top 0.4: T12.1 27.79,31.02 30.04,31.02 30.04,32.52 31.29,33.77 35.54,33.77 35.54,31.27 R24.1
N$38  (via drill 0.3)
  Top 0.4: v22.79,34.52 22.79,33.77 20.29,31.27 LED13.C | v43.29,35.52 43.29,26.77 42.04,25.52 v36.54,25.52 | v33.79,26.02 33.54,26.27 33.54,27.27 R25.2
  Bottom 0.4: v22.79,34.52 23.79,35.52 v43.29,35.52 | v36.54,25.52 36.04,26.02 v33.79,26.02
N$39
  Top 0.4: T13.3 30.04,25.77 31.29,27.02 31.29,27.27 R25.1
N$40
  Top 0.4: T13.1 27.79,26.77 30.04,26.77 30.04,28.27 31.04,29.27 35.54,29.27 35.54,27.27 R26.1
N$41  (via drill 0.3)
  Top 0.4: v22.29,24.52 22.29,25.02 20.29,27.02 LED14.C | v32.29,22.27 33.29,23.27 33.29,23.52 R27.2
  Bottom 0.4: v22.29,24.52 24.04,22.77 29.54,22.77 30.04,22.27 v32.29,22.27
N$42
  Top 0.4: T14.3 30.29,21.77 31.54,21.77 31.54,23.52 R27.1
N$43  (via drill 0.3)
  Top 0.4: v30.29,23.02 30.29,22.52 28.04,22.52 T14.1 | v34.29,22.27 35.54,22.27 35.54,22.77 R28.1
  Bottom 0.4: v30.29,23.02 33.54,23.02 v34.29,22.27
N$44  (via drill 0.3)
  Top 0.4: v21.54,22.77 20.29,22.77 LEDD0.C | v34.79,20.52 33.79,19.52 R29.2
  Bottom 0.4: v21.54,22.77 23.79,20.52 v34.79,20.52
N$45
  Top 0.4: T15.3 30.29,17.52 31.54,18.77 31.54,19.27 R29.1
N$46
  Top 0.4: T15.1 28.04,18.52 30.29,18.52 30.29,20.02 31.29,21.02 32.79,21.02 33.29,21.52 35.54,21.52 35.54,19.02 R30.1
N$47  (via drill 0.3)
  Top 0.4: v22.29,19.02 20.29,19.02 LEDD1.C | v31.54,17.77 33.54,15.77 33.54,15.52 R31.2
  Bottom 0.4: v22.29,19.02 23.54,17.77 v31.54,17.77
N$48
  Top 0.4: T16.3 30.04,13.52 31.54,15.02 31.54,15.27 R31.1
N$49  (via drill 0.3)
  Top 0.4: v29.29,14.52 27.79,14.52 T16.1 | v34.29,13.77 35.54,13.77 R32.1
  Bottom 0.4: v29.29,14.52 30.04,13.77 v34.29,13.77
N$50  (via drill 0.3)
  Top 0.4: v21.54,15.02 20.29,15.02 LEDD2.C | v32.54,13.02 33.54,12.02 33.54,11.77 R33.2
  Bottom 0.4: v21.54,15.02 23.54,13.02 v32.54,13.02
N$51
  Top 0.4: T17.3 30.29,9.77 31.54,11.02 31.54,11.52 R33.1
N$52  (via drill 0.3)
  Top 0.4: v30.29,11.02 30.29,10.77 28.04,10.77 T17.1 | v34.79,11.52 35.54,10.77 35.54,10.02 R34.1
  Bottom 0.4: v30.29,11.02 30.79,11.52 v34.79,11.52
N$53
  Top 0.4: LEDD3.C 20.04,11.02 19.04,10.02 19.04,7.52 23.79,2.77 33.54,2.77 33.54,7.77 R35.2
N$54
  Top 0.4: T18.3 30.04,5.27 31.54,5.27 31.54,7.77 R35.1
N$55  (via drill 0.3)
  Top 0.4: v30.79,6.27 27.79,6.27 T18.1 | v34.79,7.02 35.04,6.77 35.04,5.77 R36.1
  Bottom 0.4: v30.79,6.27 31.54,7.02 v34.79,7.02
N$56
  Top 0.4: T19.3 46.29,41.52 46.29,35.77 45.04,34.52 R37.1
N$57  (via drill 0.3)
  Top 0.4: v45.54,37.02 45.54,39.27 T19.1 | v49.79,37.02 50.54,36.27 50.54,34.52 R38.1
  Bottom 0.4: v49.79,37.02 v45.54,37.02
N$58  (via drill 0.3)
  Top 0.4: v52.04,23.52 52.04,27.27 51.29,28.02 LEDD5.C | v47.29,22.77 47.04,22.52 47.04,21.52 R39.2
  Bottom 0.4: v52.04,23.52 51.29,22.77 v47.29,22.77
N$59
  Top 0.4: T20.3 46.29,28.77 46.29,22.77 45.04,21.52 R39.1
N$60  (via drill 0.3)
  Top 0.4: v45.54,23.52 45.54,26.52 T20.1 | v49.79,23.52 50.54,22.77 50.54,21.52 R40.1
  Bottom 0.4: v49.79,23.52 v45.54,23.52
N$61  (via drill 0.3)
  Top 0.4: v52.29,13.27 52.29,16.02 51.29,17.02 LEDD6.C | v47.54,11.77 47.29,11.52 47.29,10.52 R41.2
  Bottom 0.4: v52.29,13.27 50.79,11.77 v47.54,11.77
N$62
  Top 0.4: T21.3 46.29,17.52 44.54,17.52 44.54,11.02 45.04,10.52 R41.1
N$63  (via drill 0.3)
  Top 0.4: v47.54,13.27 45.54,15.27 T21.1 | v49.79,12.52 50.54,11.77 50.54,10.52 R42.1
  Bottom 0.4: v47.54,13.27 48.29,12.52 v49.79,12.52
N$64
  Top 0.4: LEDD7.C 51.04,6.77 52.04,5.77 52.04,4.02 51.79,3.77 47.04,3.77 47.04,2.02 R43.2
N$65
  Top 0.4: T22.3 46.29,7.52 46.29,3.27 45.29,2.27 45.29,2.02 R43.1
N$66  (via drill 0.3)
  Top 0.4: v43.79,3.02 43.79,3.77 45.29,5.27 T22.1 | v49.54,3.02 50.54,2.02 R44.1
  Bottom 0.4: v49.54,3.02 v43.79,3.02
N$67  (via drill 0.3)
  Top 0.4: v68.79,11.52 68.79,2.77 59.79,2.77 57.79,4.77 LEDD8.C | v71.54,12.52 70.29,13.77 R45.2
  Bottom 0.4: v68.79,11.52 69.79,12.52 v71.54,12.52
N$68
  Top 0.4: T23.3 69.29,17.52 68.79,17.02 68.79,13.02 70.04,11.77 R45.1
N$69  (via drill 0.3)
  Top 0.4: v72.29,15.52 72.29,16.02 71.79,16.52 T23.1 | v82.54,14.27 82.54,9.52 84.29,7.77 R46.1
  Bottom 0.4: v72.29,15.52 72.54,15.27 81.54,15.27 v82.54,14.27
N$70  (via drill 0.3)
  Top 0.4: v56.54,2.02 56.54,9.77 57.54,10.77 LEDD9.C | v81.04,2.02 86.04,7.02 v86.04,28.77 | v76.54,33.27 75.54,34.27 75.54,36.77 76.79,38.02 R47.2
  Bottom 0.4: v81.04,2.02 v56.54,2.02 | v86.04,28.77 86.04,33.27 v76.54,33.27
N$71  (via drill 0.3)
  Top 0.4: v69.29,22.77 69.29,21.77 T24.3 | v77.54,24.77 77.29,25.02 77.29,35.77 77.04,36.02 R47.1
  Bottom 0.4: v69.29,22.77 71.29,24.77 v77.54,24.77
N$72  (via drill 0.3)
  Top 0.4: v70.54,19.77 70.54,20.52 71.54,20.52 T24.1 | v74.79,19.77 77.54,17.02 77.54,13.77 76.29,12.52 R48.1
  Bottom 0.4: v74.79,19.77 v70.54,19.77
N$73  (via drill 0.3)
  Top 0.4: v58.79,43.27 58.79,31.27 56.54,29.02 56.54,26.27 58.79,24.02 58.79,17.77 57.79,16.77 LEDD10.C | v75.54,43.77 76.79,43.77 R49.2
  Bottom 0.4: v58.79,43.27 59.29,43.77 v75.54,43.77
N$74  (via drill 0.3)
  Top 0.4: v70.54,27.52 70.54,26.77 69.54,25.77 T25.3 | v78.04,27.52 78.04,40.52 77.04,41.52 R49.1
  Bottom 0.4: v78.04,27.52 v70.54,27.52
N$75  (via drill 0.3)
  Top 0.4: v70.29,22.77 70.29,23.27 71.54,24.52 T25.1 | v87.54,22.77 89.54,24.77 89.54,25.27 R50.1
  Bottom 0.4: v87.54,22.77 v70.29,22.77
N$76  (via drill 0.3)
  Top 0.4: v58.79,7.52 58.79,11.77 56.54,14.02 56.54,20.52 57.54,21.52 LEDD11.C | v74.79,5.27 78.04,5.27 78.04,7.27 77.04,8.27 R51.2
  Bottom 0.4: v58.79,7.52 61.04,5.27 v74.79,5.27
N$77  (via drill 0.3)
  Top 0.4: v68.04,7.27 68.04,12.52 64.79,12.52 63.54,13.77 63.54,25.27 66.04,25.27 67.29,26.52 67.29,27.52 69.29,29.52 T26.3 | v75.54,7.27 76.79,7.27 76.79,6.52 R51.1
  Bottom 0.4: v75.54,7.27 v68.04,7.27
N$78  (via drill 0.3)
  Top 0.4: v70.29,28.52 71.54,28.52 T26.1 | v87.79,28.02 89.54,29.77 R52.1
  Bottom 0.4: v70.29,28.52 70.54,28.27 79.54,28.27 79.79,28.02 v87.79,28.02
N$79  (via drill 0.3)
  Top 0.4: v59.04,28.27 57.79,27.02 LEDD12.C | v63.29,28.52 63.54,28.77 63.54,37.77 69.54,43.77 74.79,43.77 74.79,26.52 76.04,25.27 R53.2
  Bottom 0.4: v59.04,28.27 59.29,28.52 v63.29,28.52
N$80  (via drill 0.3)
  Top 0.4: v70.29,32.52 70.29,32.77 69.54,33.52 T27.3 | v73.54,32.52 73.54,25.52 76.04,23.02 R53.1
  Bottom 0.4: v73.54,32.52 v70.29,32.52
N$81  (via drill 0.3)
  Top 0.4: v70.54,35.52 70.54,34.02 71.54,33.02 T27.1 | v88.29,35.52 89.04,34.77 89.54,34.77 R54.1
  Bottom 0.4: v70.54,35.52 71.04,35.02 79.04,35.02 79.54,35.52 v88.29,35.52
N$82  (via drill 0.3)
  Top 0.4: v56.54,40.02 56.54,33.02 57.54,32.02 LEDD13.C | v85.54,39.52 85.79,39.27 85.79,35.52 86.29,35.02 86.29,30.02 84.79,28.52 84.79,25.02 R55.2
  Bottom 0.4: v56.54,40.02 57.79,41.27 83.79,41.27 v85.54,39.52
N$83  (via drill 0.3)
  Top 0.4: v70.29,39.02 70.29,38.77 69.54,38.02 T28.3 | v80.29,39.52 82.54,37.27 82.54,25.02 84.54,23.02 R55.1
  Bottom 0.4: v70.29,39.02 70.79,39.52 v80.29,39.52
N$84  (via drill 0.3)
  Top 0.4: v72.04,35.77 72.04,36.52 71.79,36.77 T28.1 | v73.54,38.77 v73.54,36.27 | v88.29,38.77 89.54,38.77 89.54,39.02 R56.1
  Bottom 0.4: v72.04,35.77 72.54,36.27 v73.54,36.27 | v88.29,38.77 v73.54,38.77
N$85  (via drill 0.3)
  Top 0.4: v58.04,38.27 58.04,37.52 57.79,37.27 LEDD14.C | v83.54,36.27 84.79,35.02 84.79,34.27 R57.2
  Bottom 0.4: v58.04,38.27 58.29,38.02 81.79,38.02 v83.54,36.27
N$86  (via drill 0.3)
  Top 0.4: v68.29,31.02 68.29,40.77 69.29,41.77 T29.3 | v83.29,30.77 84.79,32.27 R57.1
  Bottom 0.4: v68.29,31.02 68.54,30.77 v83.29,30.77
N$87  (via drill 0.3)
  Top 0.4: v70.29,43.02 70.54,42.77 70.54,42.02 71.54,41.02 T29.1 | v90.54,6.52 90.29,6.77 90.29,7.77 R58.1
  Bottom 0.4: v70.29,43.02 70.54,42.77 87.29,42.77 90.54,39.52 v90.54,6.52
N$88  (via drill 0.3)
  Top 0.4: v58.04,40.52 58.04,41.77 57.79,42.02 LEDD15.C | v82.79,40.52 84.04,40.52 R59.2
  Bottom 0.4: v82.79,40.52 v58.04,40.52
N$89  (via drill 0.3)
  Top 0.4: v72.29,11.52 71.29,10.52 71.29,9.02 70.29,8.02 T30.3 | v85.54,41.52 82.04,41.52 82.04,40.27 83.54,38.77 84.04,38.77 R59.1
  Bottom 0.4: v72.29,11.52 73.79,13.02 85.29,13.02 89.79,17.52 89.79,39.27 87.54,41.52 v85.54,41.52
N$90
  Top 0.4: T30.1 72.54,6.77 73.29,6.02 73.29,3.77 75.79,1.27 88.29,1.27 88.29,11.27 89.79,12.77 R60.1
ROM3_N
  Bottom 0.4: IC2.20 25.04,16.52 25.54,16.02 38.29,16.02 38.79,15.52 41.79,15.52 42.79,16.52 65.29,16.52 IC1.20

### Text on the board
tPlace: THE BACKOFFICE @backofficeshow www.backofficeshow.com www.youtube.com/backofficeshow | SUPER / MEGA CART | ROM 3 HIGH | ROM 3 LOW